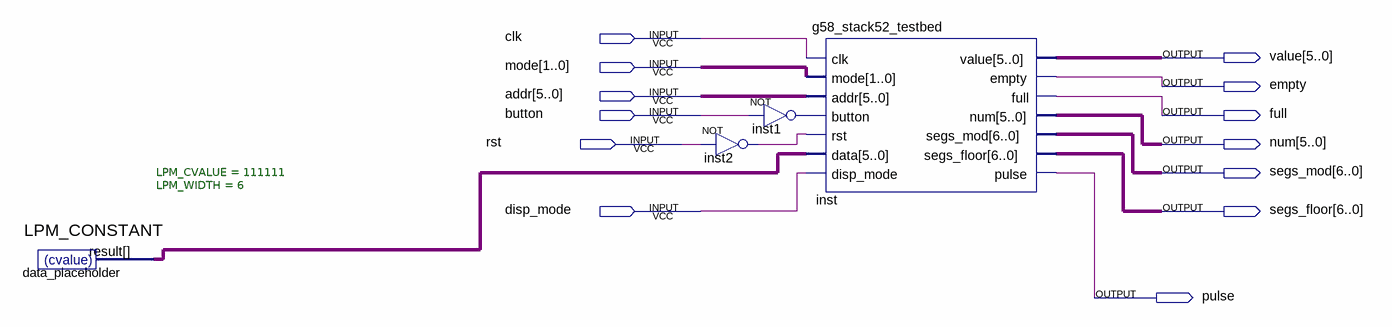
[diagram p0: schematic sheet]
// Quartus schematic g58_testbed.bdf as structural Verilog: 4 symbols, 13 pins
module g58_testbed (
  input  clk,
  input  [1:0] mode,
  input  [5:0] addr,
  input  button,
  input  rst,
  input  disp_mode,
  output [5:0] value,
  output empty,
  output full,
  output [5:0] num,
  output [6:0] segs_mod,
  output [6:0] segs_floor,
  output pulse
);

  wire inst1_out, inst2_out;
  wire [5:0] data_placeholder_result;

  LPM_CONSTANT #(.LPM_CVALUE(111111), .LPM_WIDTH(6)) data_placeholder (.result(data_placeholder_result));
  not inst1 (inst1_out, button);
  not inst2 (inst2_out, rst);
  g58_stack52_testbed inst (
    .clk(clk), .mode(mode), .addr(addr), .button(inst1_out), .rst(inst2_out), .data(data_placeholder_result),
    .disp_mode(disp_mode), .value(value), .empty(empty), .full(full), .num(num), .segs_mod(segs_mod),
    .segs_floor(segs_floor), .pulse(pulse));
endmodule
